# Altium schematic sheet Wifiboard.SchDoc
size A3; SheetNumber: 4; SheetTotal: 4
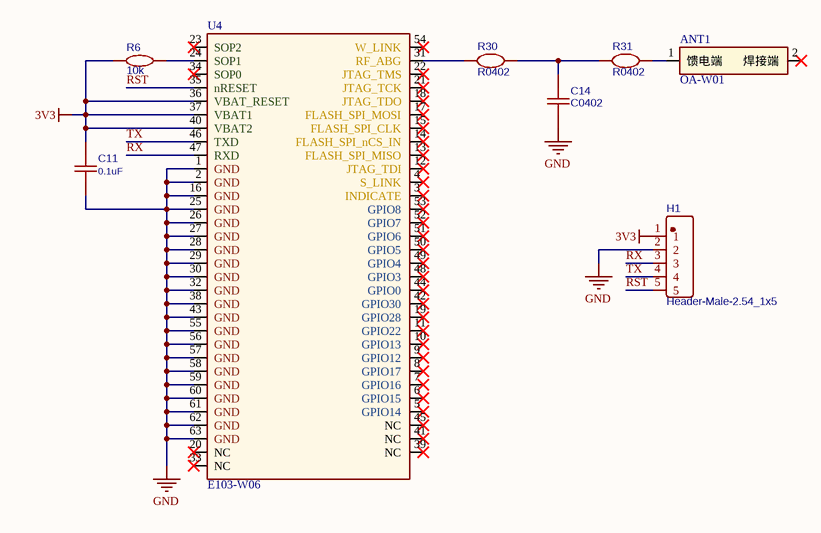
[diagram p0: Wifiboard.SchDoc]

## Parts
ANT1  OA-W01  [OA-W01]
C11  0.1uF  [C0603]
C14  C0402  [C0402]
H1  Header-Male-2.54_1x5  [HDR2.54-LI-5P]
R6  10k  [R0603]
R30  R0402  [R0402]
R31  R0402  [R0402]
U4  E103-W06  [E103-W06]

## Nets
3V3: C11.1 H1.1 R6.2 U4.36(VBAT_RESET) U4.37(VBAT1) U4.40(VBAT2)
GND: C11.2 C14.1 H1.2 U4.1(GND) U4.2(GND) U4.16(GND) U4.25(GND) U4.26(GND) U4.27(GND) U4.28(GND) U4.29(GND) U4.30(GND) U4.32(GND) U4.38(GND) U4.43(GND) U4.55(GND) U4.56(GND) U4.57(GND) U4.58(GND) U4.59(GND) U4.60(GND) U4.61(GND) U4.62(GND) U4.63(GND)
RST: H1.5 U4.35(nRESET)
RX: H1.3 U4.47(RXD)
TX: H1.4 U4.46(TXD)
NetANT1_1: ANT1.1(馈电端) R31.2
NetC14_2: C14.2 R30.2 R31.1
NetR6_1: R6.1 U4.24(SOP1)
NetR30_1: R30.1 U4.31(RF_ABG)

Not connected (* = marked no-connect by the designer): ANT1 2(焊接端)*; U4 3(INDICATE)* 4(S_LINK)* 5(GPIO14)* 6(GPIO15)* 7(GPIO16)* 8(GPIO17)* 9(GPIO12)* 10(GPIO13)* 11(GPIO22)* 12(JTAG_TDI)* 13(FLASH_SPI_MISO)* 14(FLASH_SPI_nCS_IN)* 15(FLASH_SPI_CLK)* 17(FLASH_SPI_MOSI)* 18(JTAG_TDO)* 19(GPIO28)* 20(NC)* 21(JTAG_TCK)* 22(JTAG_TMS)* 23(SOP2)* 33(NC)* 34(SOP0)* 39(NC)* 41(NC)* 42(GPIO30)* 44(GPIO0)* 45(NC)* 48(GPIO3)* 49(GPIO4)* 50(GPIO5)* 51(GPIO6)* 52(GPIO7)* 53(GPIO8)* 54(W_LINK)*

## Library data of the parts
ANT1 = OA-W01: 2.4G/5G贴片陶瓷天线
C11 = C0603: BOM_Manufacturer: YAGEO; BOM_Manufacturer Part: CC0603KRX7R9BB104; nameAlias: Capacitance; BOM_Supplier: LCSC; BOM_Supplier Part: C14663; BOM_JLCPCB Part Class: Basic Part; spicePre: C; spiceSymbolName: CC0603KRX7R9BB104
C14 = C0402: BOM_Manufacturer: YAGEO; BOM_Manufacturer Part: CC0402KRX7R7BB104; nameAlias: Capacitance; BOM_Supplier: LCSC; BOM_Supplier Part: C60474; BOM_JLCPCB Part Class: Extended Part; spicePre: C; spiceSymbolName: CC0402KRX7R7BB104
H1 = Header-Male-2.54_1x5: BOM_Manufacturer: Boom Precision Elec; BOM_Manufacturer Part: C247921; Contributor: LCSC; BOM_Supplier: LCSC; BOM_Supplier Part: C247921; BOM_JLCPCB Part Class: Extended Part; spicePre: H; spiceSymbolName: C247921
R6 = R0603: BOM_Manufacturer: YAGEO; BOM_Manufacturer Part: SR0603JR-071RL; nameAlias: Resistance (Ohms); Contributor: LCSC; Resistance: 1Ω; BOM_Supplier: LCSC; BOM_Supplier Part: C326890; BOM_JLCPCB Part Class: Extended Part; spicePre: R; spiceSymbolName: SR0603JR-071RL
R30 R31 = R0402: BOM_Manufacturer: YAGEO; BOM_Manufacturer Part: SR0402FR-0710KL; Contributor: LCSC; Resistance: 10kΩ; BOM_Supplier: LCSC; BOM_Supplier Part: C723595; BOM_JLCPCB Part Class: Extended Part; spicePre: R; spiceSymbolName: SR0402FR-0710KL
U4 = E103-W06: 2.4/5Gwifi模块